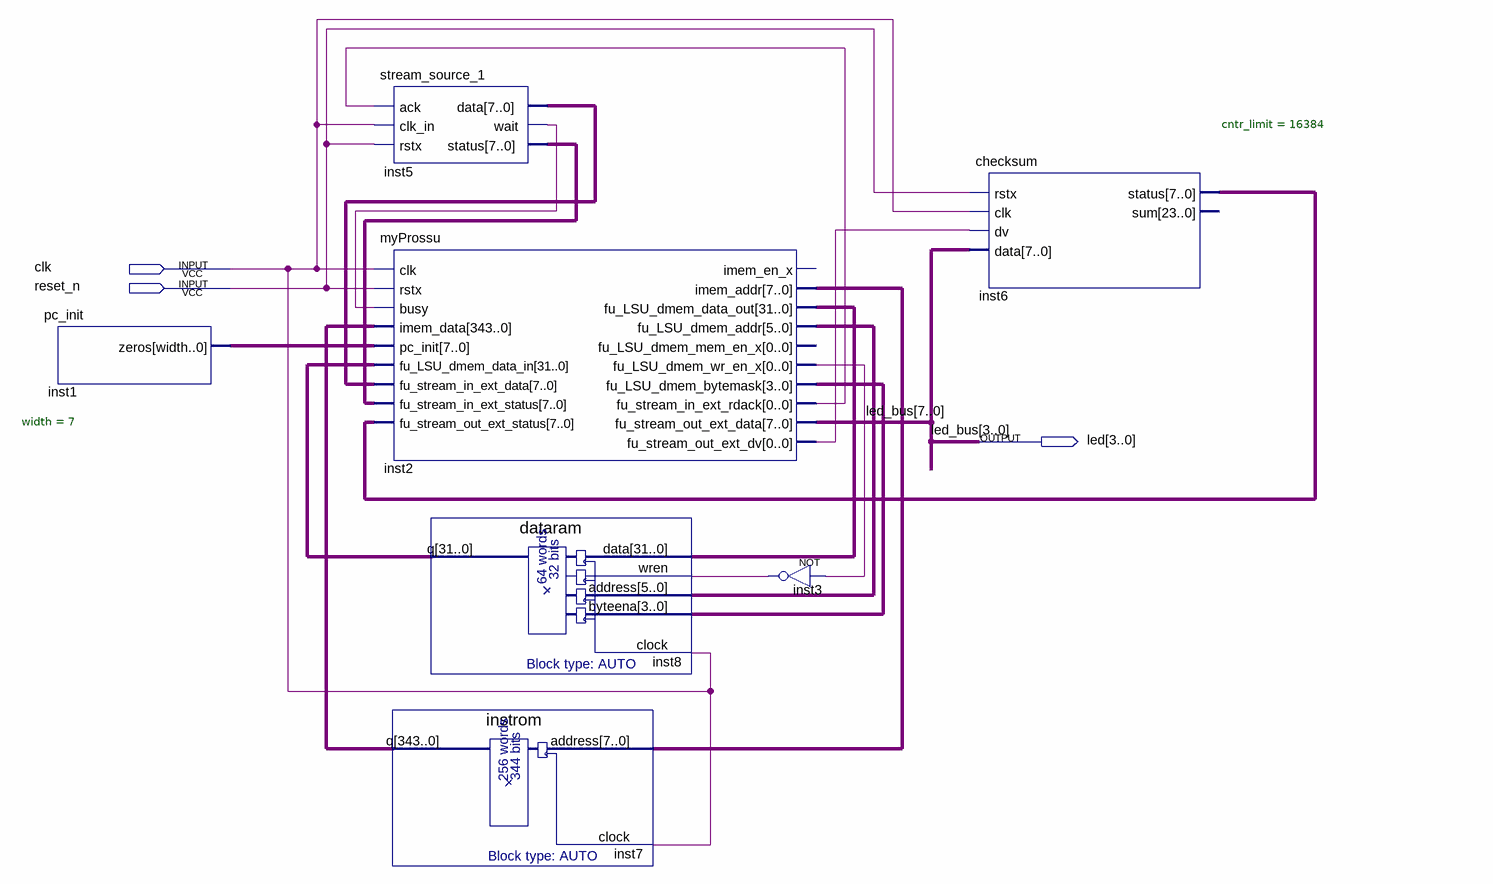
[diagram p0: schematic sheet]
// Quartus schematic tta_fir.bdf as structural Verilog: 7 symbols, 3 pins
module tta_fir (
  input  clk,
  input  reset_n,
  output [3:0] led
);

  wire inst2_fu_lsu_dmem_wr_en_x, inst2_fu_stream_in_ext_rdack, inst2_fu_stream_out_ext_dv, inst3_out,
       inst5_wait;
  wire [3:0] inst2_fu_lsu_dmem_bytemask;
  wire [5:0] inst2_fu_lsu_dmem_addr;
  wire [7:0] inst1_zeros, inst2_imem_addr, inst5_data, inst5_status, inst6_status;
  wire [7:4] led_bus;
  wire [31:0] inst2_fu_lsu_dmem_data_out, inst8_q;
  wire [343:0] inst7_q;

  pc_init #(.width(7)) inst1 (.zeros(inst1_zeros));
  stream_source_1 inst5 (
    .ack(inst2_fu_stream_in_ext_rdack), .clk_in(clk), .rstx(reset_n), .data(inst5_data), .\wait (inst5_wait),
    .status(inst5_status));
  myProssu inst2 (
    .clk(clk), .rstx(reset_n), .busy(inst5_wait), .imem_data(inst7_q), .pc_init(inst1_zeros),
    .fu_LSU_dmem_data_in(inst8_q), .fu_stream_in_ext_data(inst5_data),
    .fu_stream_in_ext_status(inst5_status), .fu_stream_out_ext_status(inst6_status),
    .imem_addr(inst2_imem_addr), .fu_LSU_dmem_data_out(inst2_fu_lsu_dmem_data_out),
    .fu_LSU_dmem_addr(inst2_fu_lsu_dmem_addr), .fu_LSU_dmem_wr_en_x(inst2_fu_lsu_dmem_wr_en_x),
    .fu_LSU_dmem_bytemask(inst2_fu_lsu_dmem_bytemask), .fu_stream_in_ext_rdack(inst2_fu_stream_in_ext_rdack),
    .fu_stream_out_ext_data({led_bus, led}), .fu_stream_out_ext_dv(inst2_fu_stream_out_ext_dv));  // open: imem_en_x, fu_LSU_dmem_mem_en_x
  dataram inst8 (
    .data(inst2_fu_lsu_dmem_data_out), .wren(inst3_out), .address(inst2_fu_lsu_dmem_addr),
    .byteena(inst2_fu_lsu_dmem_bytemask), .clock(clk), .q(inst8_q));
  instrom inst7 (.address(inst2_imem_addr), .clock(clk), .q(inst7_q));
  not inst3 (inst3_out, inst2_fu_lsu_dmem_wr_en_x);
  checksum #(.cntr_limit(16384)) inst6 (
    .rstx(reset_n), .clk(clk), .dv(inst2_fu_stream_out_ext_dv), .data({led_bus, led}), .status(inst6_status));  // open: sum

  // Other names for the same wires on the sheet: led_bus[3:0] = led
endmodule
